# EAGLE schematic KELU1-0232 (EAGLE 9.0.0)

## Sheet 1 of 7: IGBT Bridge
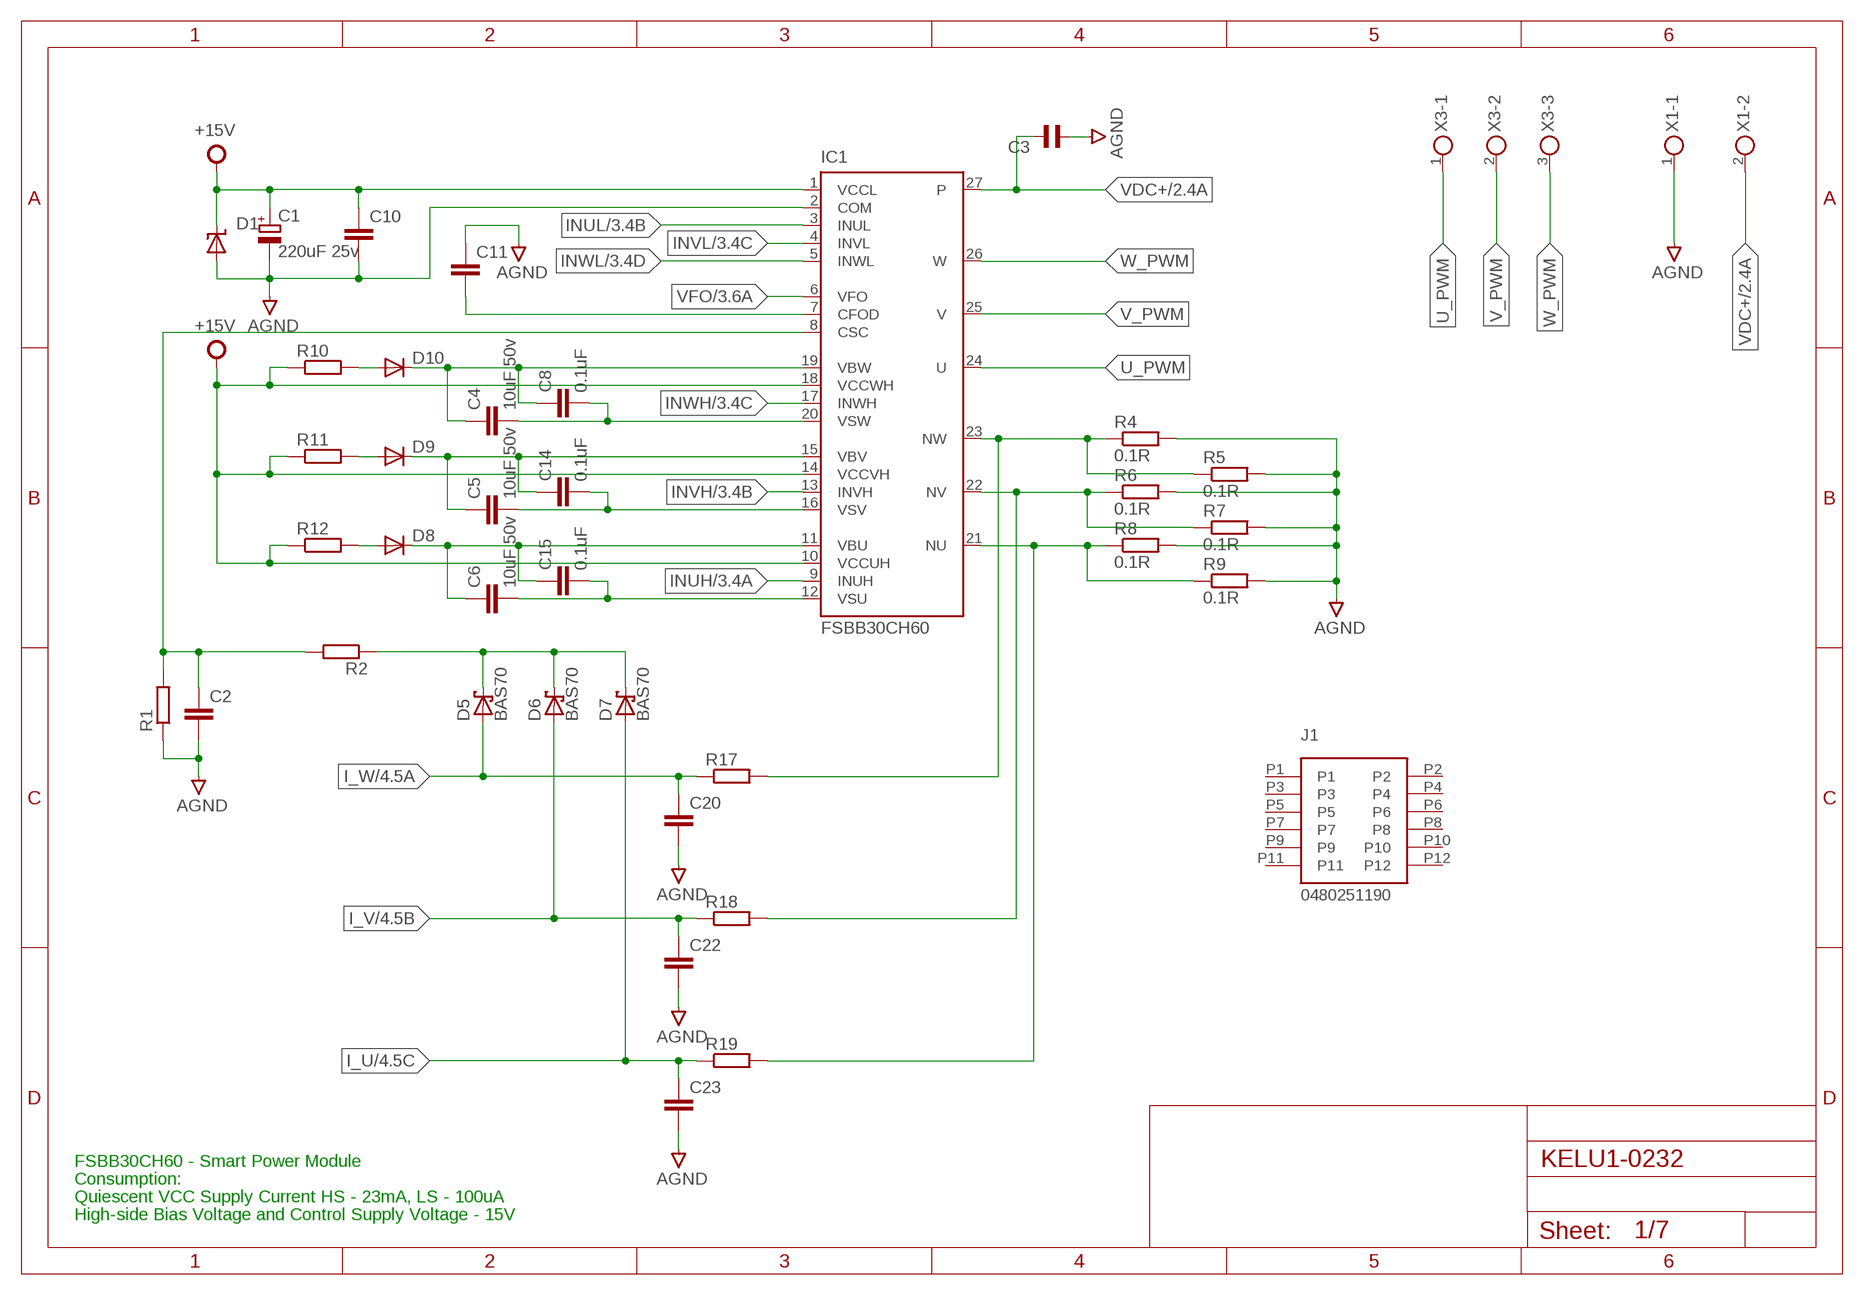
[diagram p0: schematic, sheet 1]

### Parts
C1  220uF 25v  CPOL-EU140CLH-1010  [140CLH-1010]
C2  C-EUC0603  [C0603]
C3  C-EU150-091X182  [C150-091X182]
C4  10uF 50v  C-EUC1210K  [C1210K]
C5  10uF 50v  C-EUC1210K  [C1210K]
C6  10uF 50v  C-EUC1210K  [C1210K]
C8  0.1uF  C-EUC0805  [C0805]
C10  C-EUC0603  [C0603]
C11  C-EUC0603  [C0603]
C14  0.1uF  C-EUC0805  [C0805]
C15  0.1uF  C-EUC0805  [C0805]
C20  C-EUC0603  [C0603]
C22  C-EUC0603  [C0603]
C23  C-EUC0603  [C0603]
D1  SUPPRESSOR-SMBJ  [SMBJ]
D5  BAS70  [SOT23]
D6  BAS70  [SOT23]
D7  BAS70  [SOT23]
D8  DIODE-MELF-MLL41  [MELF-MLL41]
D9  DIODE-MELF-MLL41  [MELF-MLL41]
D10  DIODE-MELF-MLL41  [MELF-MLL41]
IC1  FSBB30CH60  [FSBB30CH60]
J1  0480251190  [JACK]
R1  R-EU_R0603  [R0603]
R2  R-EU_R0603  [R0603]
R4  0.1R  R-EU_R2512  [R2512]
R5  0.1R  R-EU_R2512  [R2512]
R6  0.1R  R-EU_R2512  [R2512]
R7  0.1R  R-EU_R2512  [R2512]
R8  0.1R  R-EU_R2512  [R2512]
R9  0.1R  R-EU_R2512  [R2512]
R10  R-EU_R1206  [R1206]
R11  R-EU_R1206  [R1206]
R12  R-EU_R1206  [R1206]
R17  R-EU_R0603  [R0603]
R18  R-EU_R0603  [R0603]
R19  R-EU_R0603  [R0603]
X1  DG129-7.5-02P  [DG129-7.5-02P-14-00A]
X3  DG129-7.5-03P  [DG129-7.5-03P-14-00A]

### Nets
+15V: C1.+ C10.1 D1.C IC1.1(VCCL) IC1.10(VCCUH) IC1.14(VCCVH) IC1.18(VCCWH) R10.1 R11.1 R12.1 ; also sheet 2,7
AGND: C1.- C2.2 C3.2 C10.2 C11.1 C20.2 C22.2 C23.2 D1.A IC1.2(COM) R1.1 R4.2 R5.2 R6.2 R7.2 R8.2 R9.2 X1.1 ; also sheet 2,3,4,5,7
I_U: C23.1 D7.1(A) R19.1 ; also sheet 4
I_V: C22.1 D6.1(A) R18.1 ; also sheet 4
I_W: C20.1 D5.1(A) R17.1 ; also sheet 4
INUH: IC1.9(INUH) ; also sheet 3
INUL: IC1.3(INUL) ; also sheet 3
INVH: IC1.13(INVH) ; also sheet 3
INVL: IC1.4(INVL) ; also sheet 3
INWH: IC1.17(INWH) ; also sheet 3
INWL: IC1.5(INWL) ; also sheet 3
N$1: D8.A R12.2
N$2: D9.A R11.2
N$3: C11.2 IC1.7(CFOD)
N$4: D10.A R10.2
N$5: C4.1 C8.1 D10.C IC1.19(VBW)
N$6: C5.1 C14.1 D9.C IC1.15(VBV)
N$7: C6.1 C15.1 D8.C IC1.11(VBU)
N$8: C5.2 C14.2 IC1.16(VSV)
N$9: C6.2 C15.2 IC1.12(VSU)
N$10: C4.2 C8.2 IC1.20(VSW)
N$11: IC1.23(NW) R4.1 R5.1 R17.2
N$12: IC1.22(NV) R6.1 R7.1 R18.2
N$13: IC1.21(NU) R8.1 R9.1 R19.2
N$14: C2.1 IC1.8(CSC) R1.2 R2.2
N$15: D5.3(C) D6.3(C) D7.3(C) R2.1
U_PWM: IC1.24(U) X3.1
V_PWM: IC1.25(V) X3.2
VDC+: C3.1 IC1.27(P) X1.2 ; also sheet 2,5
VFO: IC1.6(VFO) ; also sheet 3
W_PWM: IC1.26(W) X3.3
Unconnected: J1.P1 J1.P2 J1.P3 J1.P4 J1.P5 J1.P6 J1.P7 J1.P8 J1.P9 J1.P10 J1.P11 J1.P12

### Notes on the sheet
- FSBB30CH60 - Smart Power Module
- Consumption:
- Quiescent VCC Supply Current HS - 23mA, LS - 100uA
- High-side Bias Voltage and Control Supply Voltage - 15V

## Sheet 2 of 7: Brake and Soft
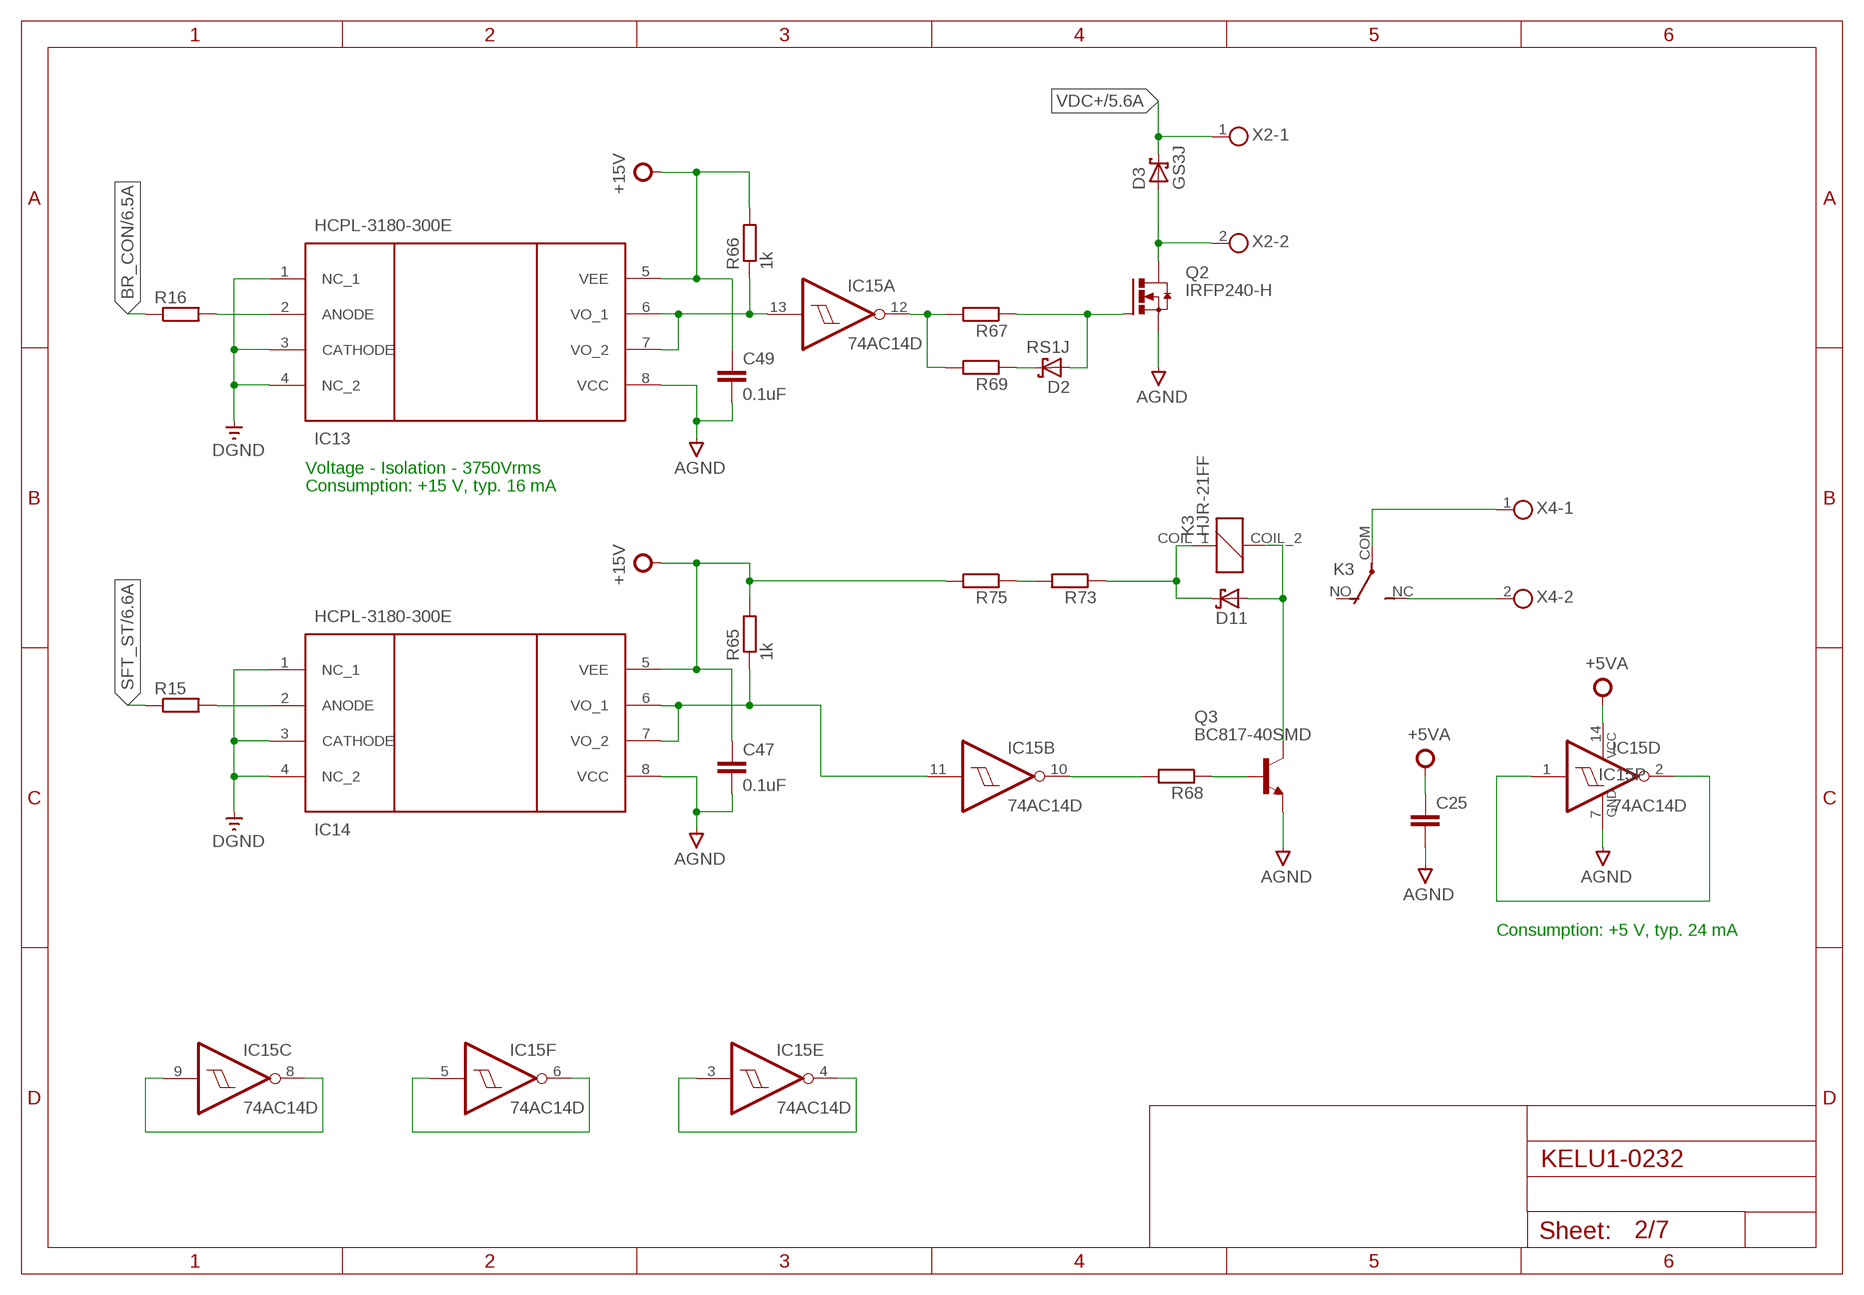
[diagram p1: schematic, sheet 2]

### Parts
C25  C-EUC0603  [C0603]
C47  0.1uF  C-EUC1206  [C1206]
C49  0.1uF  C-EUC1206  [C1206]
D2  RS1J  SCHOTTKY_SMA  [DIOM5326X292N]
D3  GS3J  SCHOTTKY_SMC  [DIOM7959X265N]
D11  SCHOTTKY_SMA  [DIOM5326X292N]
IC13  HCPL-3180-300E  [HCPL-3180]
IC14  HCPL-3180-300E  [HCPL-3180]
IC15  74AC14D  [SO14]
K3  HJR-21FF  [HJR21FF]
Q2  IRFP240-H  [TO247BH]
Q3  BC817-40SMD  [SOT23-BEC]
R15  R-EU_R0603  [R0603]
R16  R-EU_R0603  [R0603]
R65  1k  R-EU_M0805  [M0805]
R66  1k  R-EU_M0805  [M0805]
R67  R-EU_M0805  [M0805]
R68  R-EU_M0805  [M0805]
R69  R-EU_M0805  [M0805]
R73  R-EU_M0805  [M0805]
R75  R-EU_M0805  [M0805]
X2  DG129-7.5-02P  [DG129-7.5-02P-14-00A]
X4  DG129-7.5-02P  [DG129-7.5-02P-14-00A]

### Nets
+5VA: C25.1 IC15.14(P:VCC) ; also sheet 3,4,5,7
+15V: C47.1 C49.1 IC13.5(VEE) IC14.5(VEE) R65.2 R66.2 R75.2 ; also sheet 1,7
AGND: C25.2 C47.2 C49.2 IC13.8(VCC) IC14.8(VCC) IC15.7(P:GND) Q2.S Q3.E ; also sheet 1,3,4,5,7
BR_CON: R16.1 ; also sheet 6
DGND: IC13.1(NC_1) IC13.3(CATHODE) IC13.4(NC_2) IC14.1(NC_1) IC14.3(CATHODE) IC14.4(NC_2) ; also sheet 3,4,5,6,7
N$36: IC13.2(ANODE) R16.2
N$47: IC14.2(ANODE) R15.2
N$48: Q3.B R68.1
N$53: IC13.6(VO_1) IC13.7(VO_2) IC15.13(A:I) R66.1
N$56: IC15.12(A:O) R67.2 R69.2
N$60: IC14.6(VO_1) IC14.7(VO_2) IC15.11(B:I) R65.1
N$61: IC15.10(B:O) R68.2
N$65: D2.A Q2.G R67.1
N$67: D2.K R69.1
N$69: K3.COM X4.1
N$72: K3.NC X4.2
N$74: D3.A Q2.D X2.2
N$75: D11.K K3.COIL_1 R73.1
N$77: D11.A K3.COIL_2 Q3.C
N$79: R73.2 R75.1
N$81: IC15.1(D:I) IC15.2(D:O)
N$86: IC15.8(C:O) IC15.9(C:I)
N$89: IC15.5(F:I) IC15.6(F:O)
N$91: IC15.3(E:I) IC15.4(E:O)
SFT_ST: R15.1 ; also sheet 6
VDC+: D3.K X2.1 ; also sheet 1,5
Unconnected: K3.NO

### Notes on the sheet
- Voltage - Isolation - 3750Vrms
- Consumption: +15 V, typ. 16 mA
- Consumption: +5 V, typ. 24 mA

## Sheet 3 of 7: Opto Driver
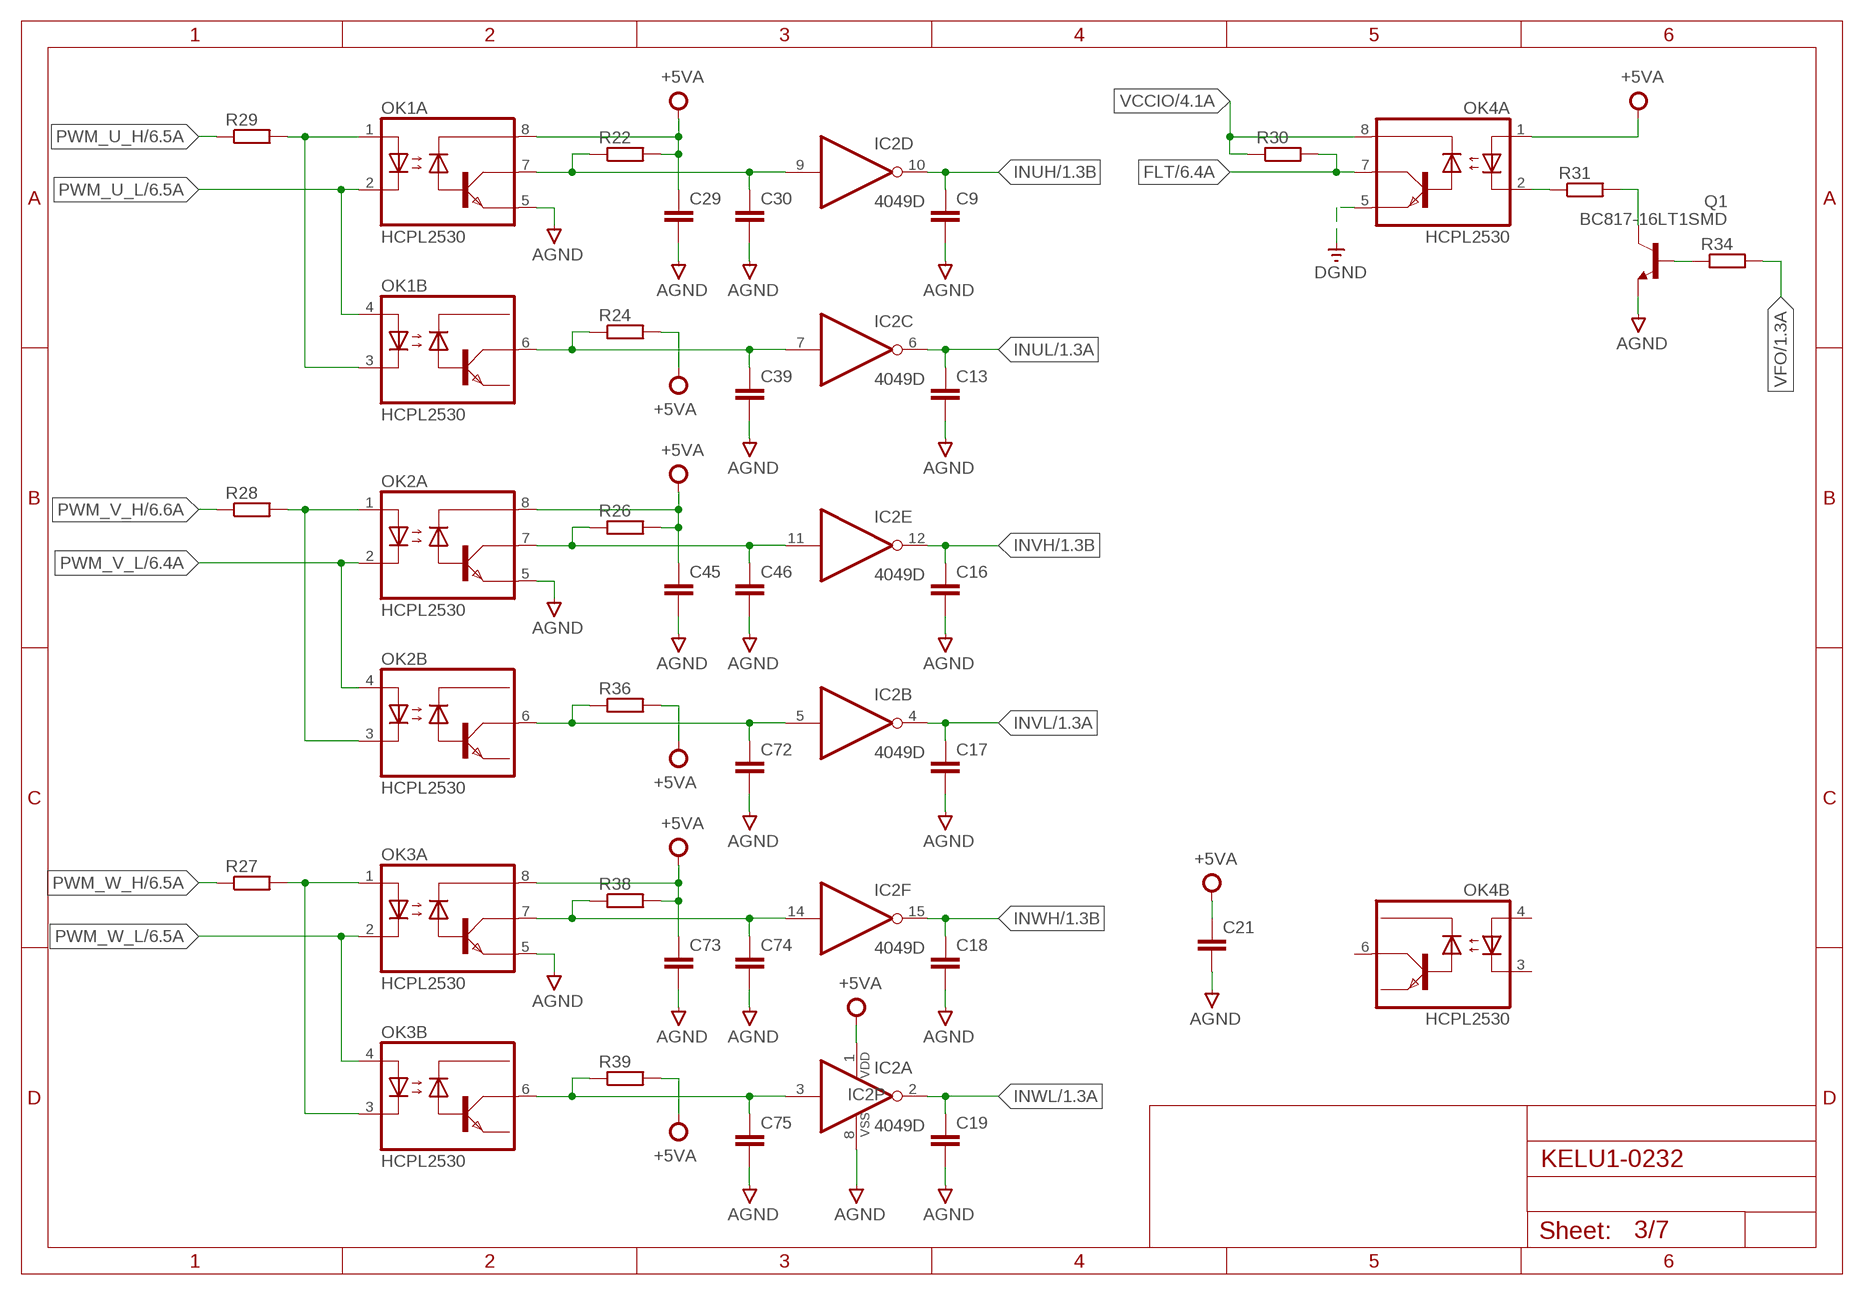
[diagram p2: schematic, sheet 3]

### Parts
C9  C-EUC0603  [C0603]
C13  C-EUC0603  [C0603]
C16  C-EUC0603  [C0603]
C17  C-EUC0603  [C0603]
C18  C-EUC0603  [C0603]
C19  C-EUC0603  [C0603]
C21  C-EUC0603  [C0603]
C29  C-EUC0603  [C0603]
C30  C-EUC0603  [C0603]
C39  C-EUC0603  [C0603]
C45  C-EUC0603  [C0603]
C46  C-EUC0603  [C0603]
C72  C-EUC0603  [C0603]
C73  C-EUC0603  [C0603]
C74  C-EUC0603  [C0603]
C75  C-EUC0603  [C0603]
IC2  4049D  [SO16]
OK1  HCPL2530  [DIL08]
OK2  HCPL2530  [DIL08]
OK3  HCPL2530  [DIL08]
OK4  HCPL2530  [DIL08]
Q1  BC817-16LT1SMD  [SOT23-BEC]
R22  R-EU_R0603  [R0603]
R24  R-EU_R0603  [R0603]
R26  R-EU_R0603  [R0603]
R27  R-EU_R0603  [R0603]
R28  R-EU_R0603  [R0603]
R29  R-EU_R0603  [R0603]
R30  R-EU_R0603  [R0603]
R31  R-EU_R0603  [R0603]
R34  R-EU_R0603  [R0603]
R36  R-EU_R0603  [R0603]
R38  R-EU_R0603  [R0603]
R39  R-EU_R0603  [R0603]

### Nets
+5VA: C21.1 C29.1 C45.1 C73.1 IC2.1(P:VDD) OK1.8(A:VCC) OK2.8(A:VCC) OK3.8(A:VCC) OK4.1(A:A1) R22.2 R24.2 R26.2 R36.2 R38.2 R39.2 ; also sheet 2,4,5,7
AGND: C9.2 C13.2 C16.2 C17.2 C18.2 C19.2 C21.2 C29.2 C30.2 C39.2 C45.2 C46.2 C72.2 C73.2 C74.2 C75.2 IC2.8(P:VSS) OK1.5(A:GND) OK2.5(A:GND) OK3.5(A:GND) Q1.E ; also sheet 1,2,4,5,7
DGND: OK4.5(A:GND) ; also sheet 2,4,5,6,7
FLT: OK4.7(A:VO1) R30.2 ; also sheet 6
INUH: C9.1 IC2.10(D:O) ; also sheet 1
INUL: C13.1 IC2.6(C:O) ; also sheet 1
INVH: C16.1 IC2.12(E:O) ; also sheet 1
INVL: C17.1 IC2.4(B:O) ; also sheet 1
INWH: C18.1 IC2.15(F:O) ; also sheet 1
INWL: C19.1 IC2.2(A:O) ; also sheet 1
N$18: C30.1 IC2.9(D:I) OK1.7(A:VO1) R22.1
N$19: C39.1 IC2.7(C:I) OK1.6(B:VO2) R24.1
N$23: OK1.1(A:A1) OK1.3(B:C2) R29.2
N$25: C46.1 IC2.11(E:I) OK2.7(A:VO1) R26.1
N$26: C72.1 IC2.5(B:I) OK2.6(B:VO2) R36.1
N$29: OK2.1(A:A1) OK2.3(B:C2) R28.2
N$31: C74.1 IC2.14(F:I) OK3.7(A:VO1) R38.1
N$34: OK4.2(A:C1) R31.1
N$35: C75.1 IC2.3(A:I) OK3.6(B:VO2) R39.1
N$37: OK3.1(A:A1) OK3.3(B:C2) R27.2
N$38: Q1.C R31.2
N$39: Q1.B R34.1
PWM_U_H: R29.1 ; also sheet 6
PWM_U_L: OK1.2(A:C1) OK1.4(B:A2) ; also sheet 6
PWM_V_H: R28.1 ; also sheet 6
PWM_V_L: OK2.2(A:C1) OK2.4(B:A2) ; also sheet 6
PWM_W_H: R27.1 ; also sheet 6
PWM_W_L: OK3.2(A:C1) OK3.4(B:A2) ; also sheet 6
VCCIO: OK4.8(A:VCC) R30.1 ; also sheet 4,5,6,7
VFO: R34.2 ; also sheet 1
Unconnected: OK4.3(B:C2) OK4.4(B:A2) OK4.6(B:VO2)

## Sheet 4 of 7: Current Sense
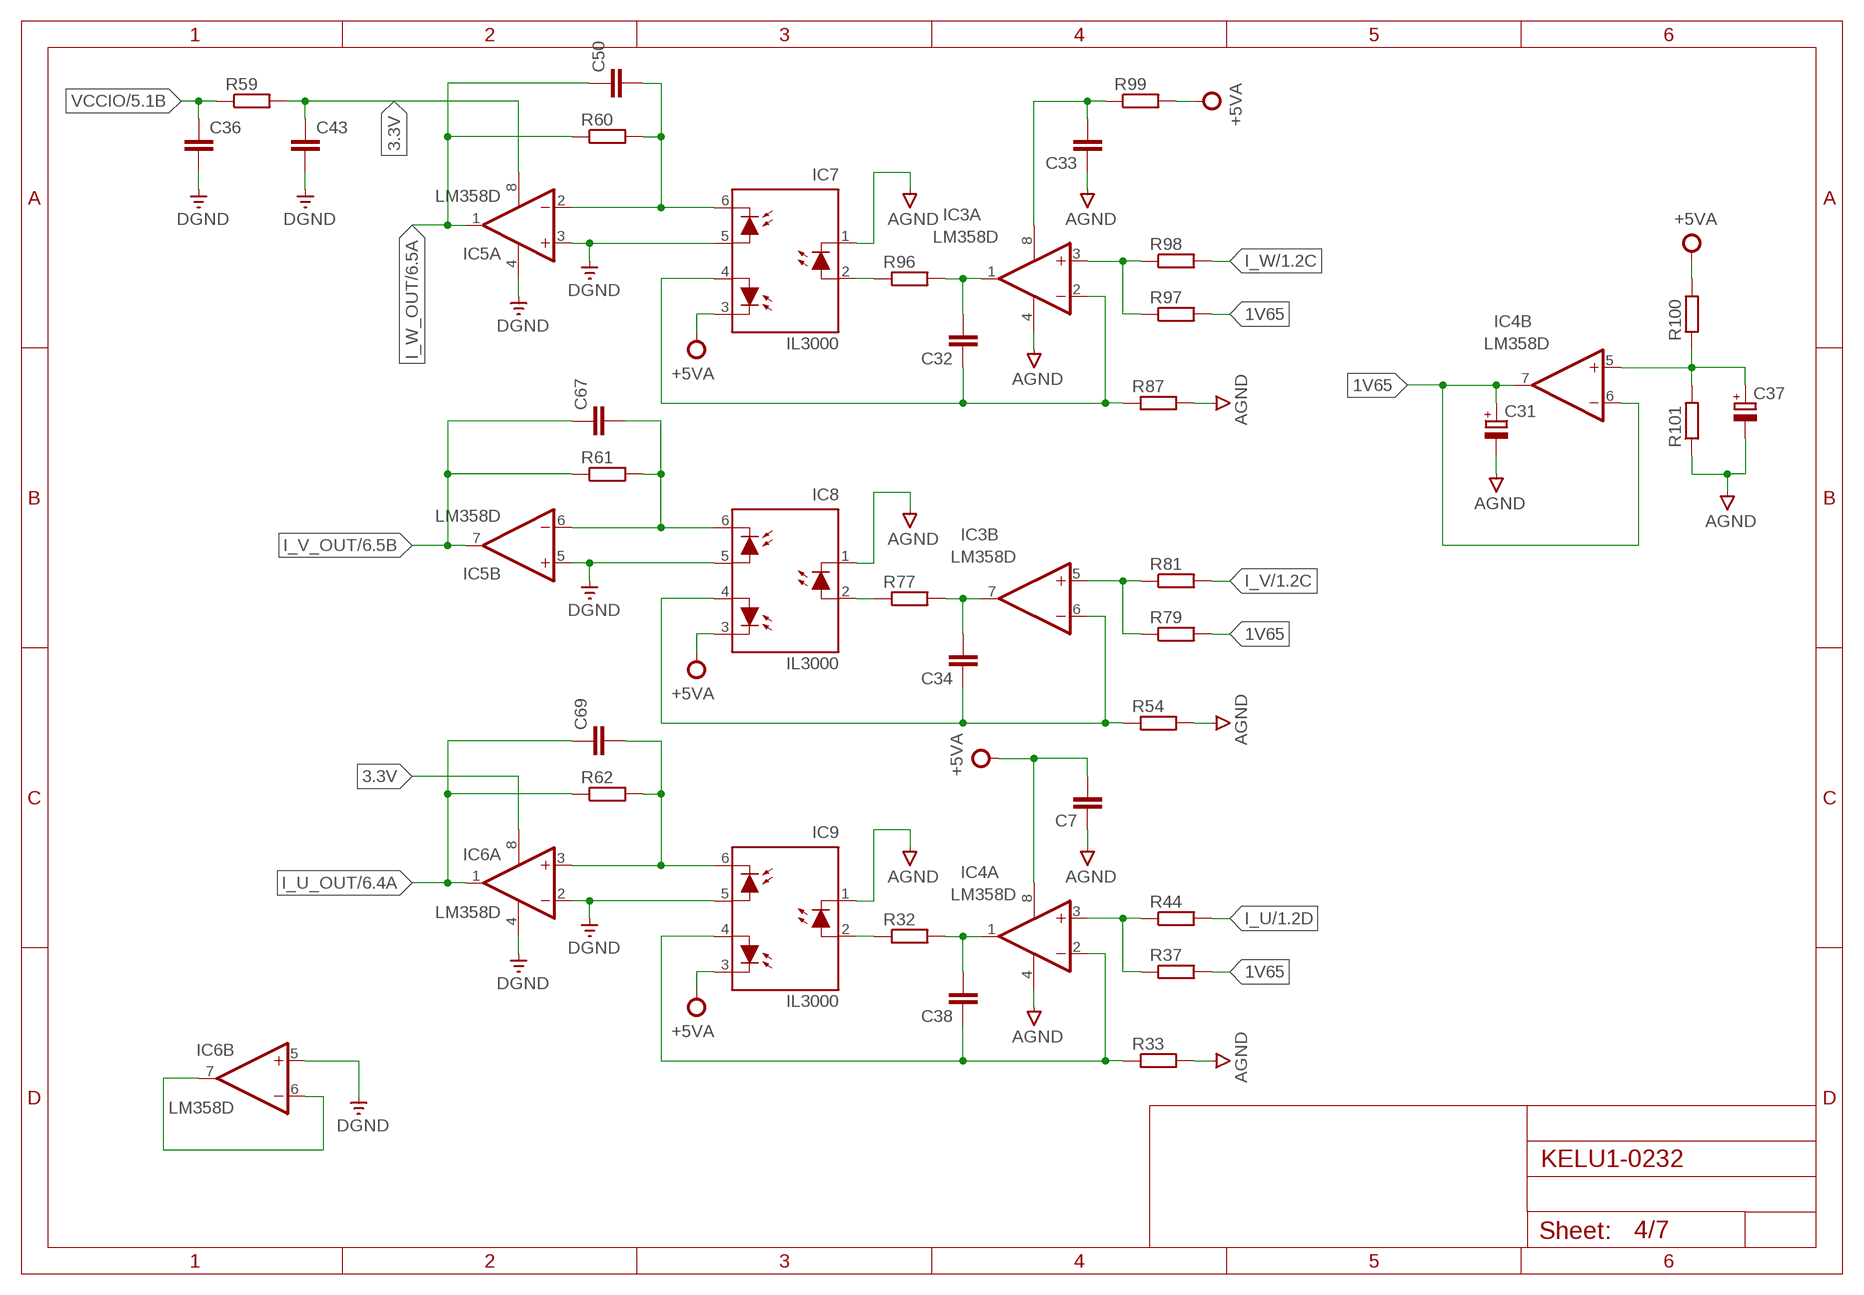
[diagram p3: schematic, sheet 4]

### Parts
C7  C-EUC0603  [C0603]
C31  CPOL-EUSMCB  [SMC_B]
C32  C-EUC0603  [C0603]
C33  C-EUC0603  [C0603]
C34  C-EUC0603  [C0603]
C36  C-EUC0603  [C0603]
C37  CPOL-EUSMCB  [SMC_B]
C38  C-EUC0603  [C0603]
C43  C-EUC0603  [C0603]
C50  C-EUC0603  [C0603]
C67  C-EUC0603  [C0603]
C69  C-EUC0603  [C0603]
IC3  LM358D  [SO08]
IC4  LM358D  [SO08]
IC5  LM358D  [SO08]
IC6  LM358D  [SO08]
IC7  IL3000  [DIL08-400]
IC8  IL3000  [DIL08-400]
IC9  IL3000  [DIL08-400]
R32  R-EU_R0603  [R0603]
R33  R-EU_R0603  [R0603]
R37  R-EU_R0603  [R0603]
R44  R-EU_R0603  [R0603]
R54  R-EU_R0603  [R0603]
R59  R-EU_R0603  [R0603]
R60  R-EU_R0603  [R0603]
R61  R-EU_R0603  [R0603]
R62  R-EU_R0603  [R0603]
R77  R-EU_R0603  [R0603]
R79  R-EU_R0603  [R0603]
R81  R-EU_R0603  [R0603]
R87  R-EU_R0603  [R0603]
R96  R-EU_R0603  [R0603]
R97  R-EU_R0603  [R0603]
R98  R-EU_R0603  [R0603]
R99  R-EU_R0603  [R0603]
R100  R-EU_R0603  [R0603]
R101  R-EU_R0603  [R0603]

### Nets
1V65: C31.+ IC4.6(B:-IN) IC4.7(B:OUT) R37.2 R79.2 R97.2
3.3V: C43.1 IC5.8(P:V+) IC6.8(P:V+) R59.2
5VA: C33.2 IC3.8(P:V+) R99.1
+5VA: C7.2 IC4.8(P:V+) IC7.3(C3) IC8.3(C3) IC9.3(C3) R99.2 R100.2 ; also sheet 2,3,5,7
AGND: C7.1 C31.- C33.1 C37.- IC3.4(P:V-) IC4.4(P:V-) IC7.1(C1) IC8.1(C1) IC9.1(C1) R33.2 R54.2 R87.2 R101.1 ; also sheet 1,2,3,5,7
DGND: C36.2 C43.2 IC5.3(A:+IN) IC5.4(P:V-) IC5.5(B:+IN) IC6.2(A:-IN) IC6.4(P:V-) IC6.5(B:+IN) IC7.5(A5) IC8.5(A5) IC9.5(A5) ; also sheet 2,3,5,6,7
I_U: R44.2 ; also sheet 1
I_U_OUT: C69.1 IC6.1(A:OUT) R62.1 ; also sheet 6
I_V: R81.2 ; also sheet 1
I_V_OUT: C67.1 IC5.7(B:OUT) R61.1 ; also sheet 6
I_W: R98.2 ; also sheet 1
I_W_OUT: C50.1 IC5.1(A:OUT) R60.1 ; also sheet 6
N$28: C32.2 IC3.1(A:OUT) R96.2
N$40: IC7.2(A2) R96.1
N$41: IC3.3(A:+IN) R97.1 R98.1
N$42: C37.+ IC4.5(B:+IN) R100.1 R101.2
N$44: C50.2 IC5.2(A:-IN) IC7.6(C6) R60.2
N$50: C32.1 IC3.2(A:-IN) IC7.4(A4) R87.1
N$54: IC8.2(A2) R77.1
N$55: C34.2 IC3.7(B:OUT) R77.2
N$57: C34.1 IC3.6(B:-IN) IC8.4(A4) R54.1
N$58: C67.2 IC5.6(B:-IN) IC8.6(C6) R61.2
N$59: C69.2 IC6.3(A:+IN) IC9.6(C6) R62.2
N$62: IC9.2(A2) R32.1
N$63: IC3.5(B:+IN) R79.1 R81.1
N$64: C38.2 IC4.1(A:OUT) R32.2
N$66: IC6.6(B:-IN) IC6.7(B:OUT)
N$68: C38.1 IC4.2(A:-IN) IC9.4(A4) R33.1
N$70: IC4.3(A:+IN) R37.1 R44.1
VCCIO: C36.1 R59.1 ; also sheet 3,5,6,7

## Sheet 5 of 7: Voltage Sense
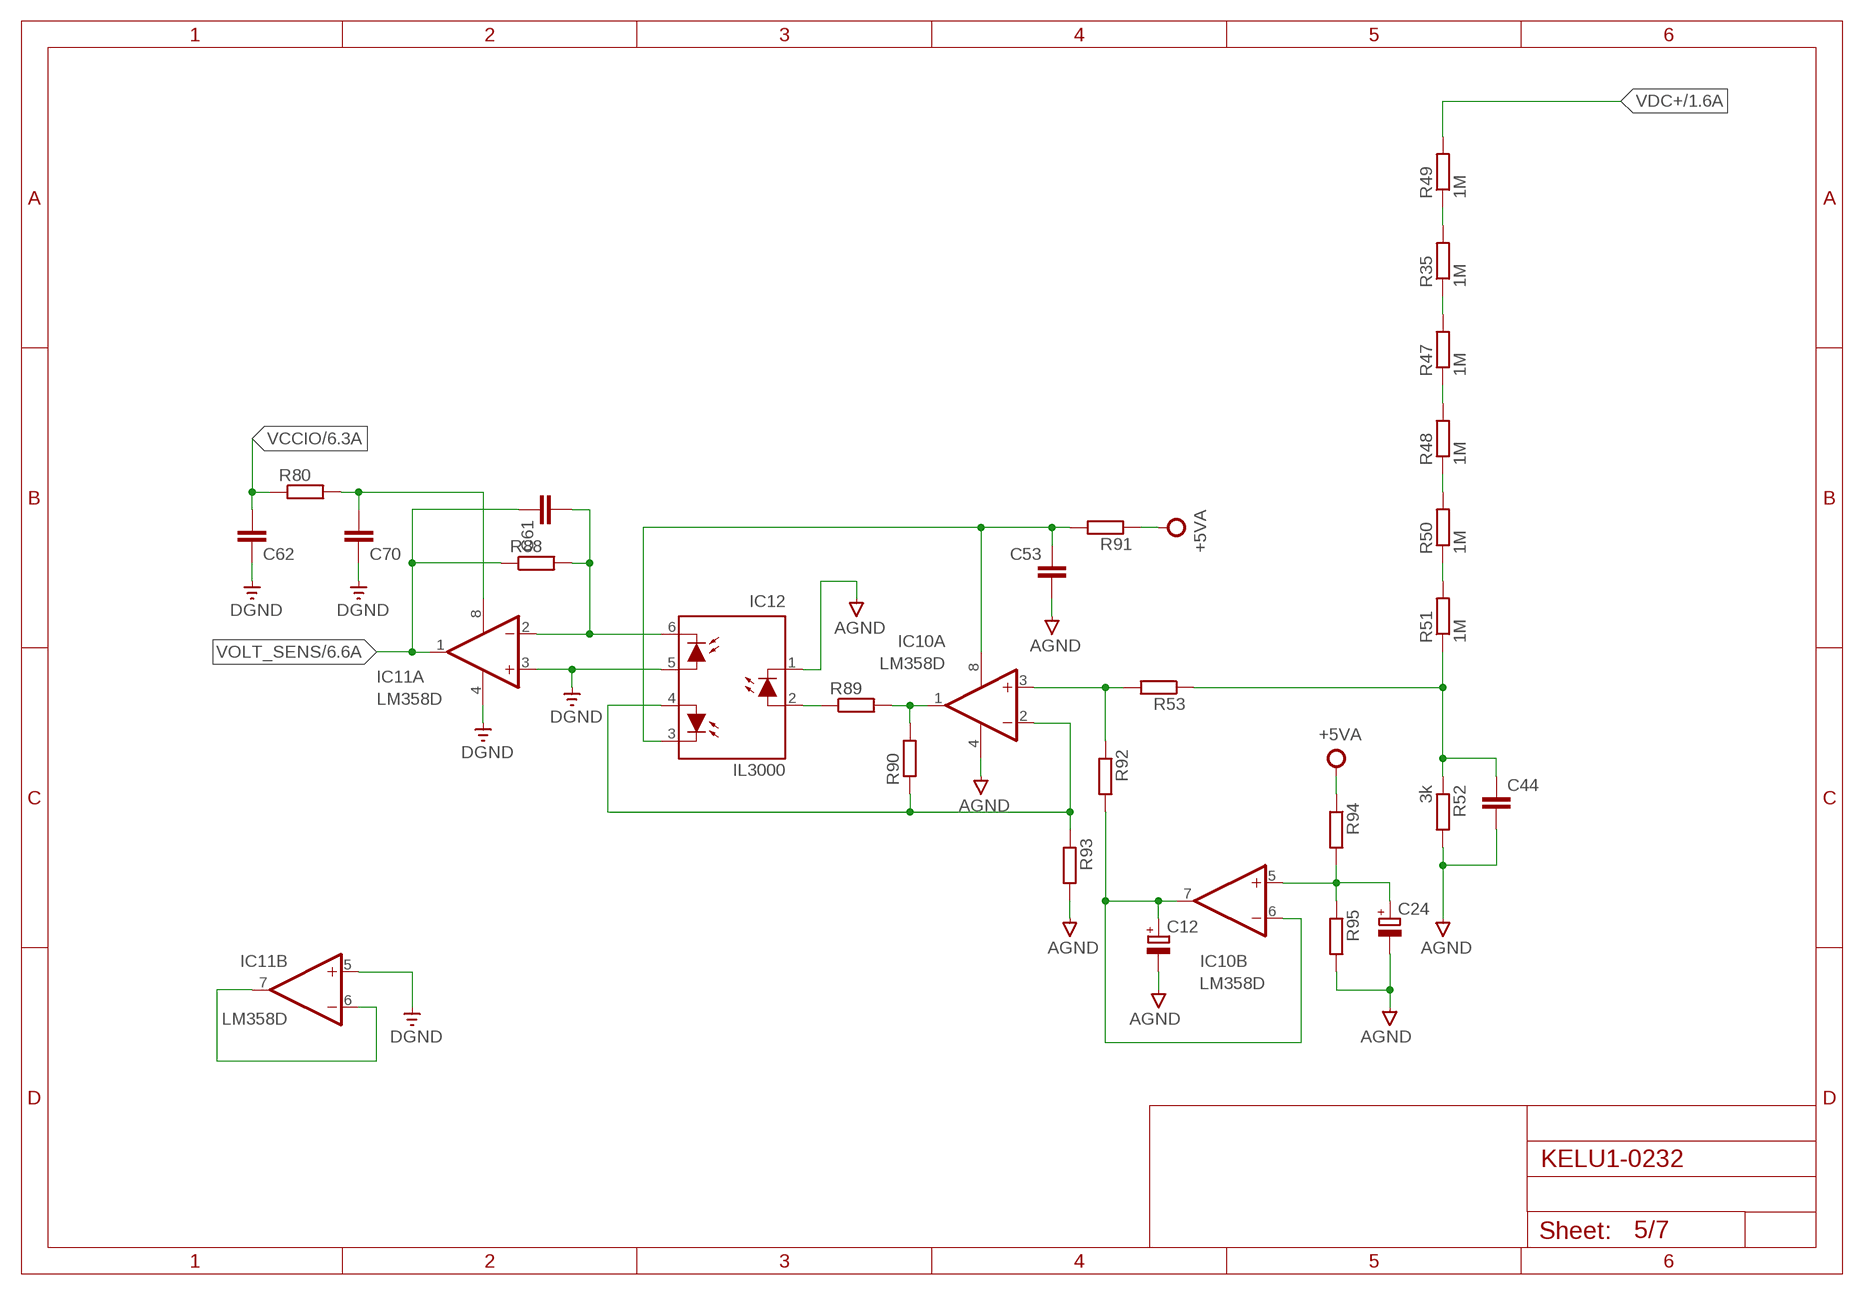
[diagram p4: schematic, sheet 5]

### Parts
C12  CPOL-EUSMCB  [SMC_B]
C24  CPOL-EUSMCB  [SMC_B]
C44  C-EUC1206  [C1206]
C53  C-EUC0603  [C0603]
C61  C-EUC0603  [C0603]
C62  C-EUC0603  [C0603]
C70  C-EUC0603  [C0603]
IC10  LM358D  [SO08]
IC11  LM358D  [SO08]
IC12  IL3000  [DIL08-400]
R35  1M  R-EU_M1206  [M1206]
R47  1M  R-EU_M1206  [M1206]
R48  1M  R-EU_M1206  [M1206]
R49  1M  R-EU_M1206  [M1206]
R50  1M  R-EU_M1206  [M1206]
R51  1M  R-EU_M1206  [M1206]
R52  3k  R-EU_M1206  [M1206]
R53  R-EU_R0603  [R0603]
R80  R-EU_R0603  [R0603]
R88  R-EU_R0603  [R0603]
R89  R-EU_R0603  [R0603]
R90  R-EU_R0603  [R0603]
R91  R-EU_R0603  [R0603]
R92  R-EU_R0603  [R0603]
R93  R-EU_R0603  [R0603]
R94  R-EU_R0603  [R0603]
R95  R-EU_R0603  [R0603]

### Nets
+5VA: R91.1 R94.1 ; also sheet 2,3,4,7
AGND: C12.- C24.- C44.2 C53.2 IC10.4(P:V-) IC12.1(C1) R52.2 R93.2 R95.2 ; also sheet 1,2,3,4,7
DGND: C62.1 C70.1 IC11.3(A:+IN) IC11.4(P:V-) IC11.5(B:+IN) IC12.5(A5) ; also sheet 2,3,4,6,7
N$16: R50.1 R51.2
N$17: R48.1 R50.2
N$20: R47.1 R48.2
N$21: R35.1 R47.2
N$22: R35.2 R49.1
N$24: IC10.3(A:+IN) R53.2 R92.1
N$27: C44.1 R51.1 R52.1 R53.1
N$30: IC12.2(A2) R89.1
N$32: IC10.1(A:OUT) R89.2 R90.2
N$33: IC10.2(A:-IN) IC12.4(A4) R90.1 R93.1
N$43: C12.+ IC10.6(B:-IN) IC10.7(B:OUT) R92.2
N$45: C61.2 IC11.2(A:-IN) IC12.6(C6) R88.2
N$46: C53.1 IC10.8(P:V+) IC12.3(C3) R91.2
N$49: C70.2 IC11.8(P:V+) R80.2
N$52: C24.+ IC10.5(B:+IN) R94.2 R95.1
N$88: IC11.6(B:-IN) IC11.7(B:OUT)
VCCIO: C62.2 R80.1 ; also sheet 3,4,6,7
VDC+: R49.2 ; also sheet 1,2
VOLT_SENS: C61.1 IC11.1(A:OUT) R88.1 ; also sheet 6

## Sheet 6 of 7: NTC Sense
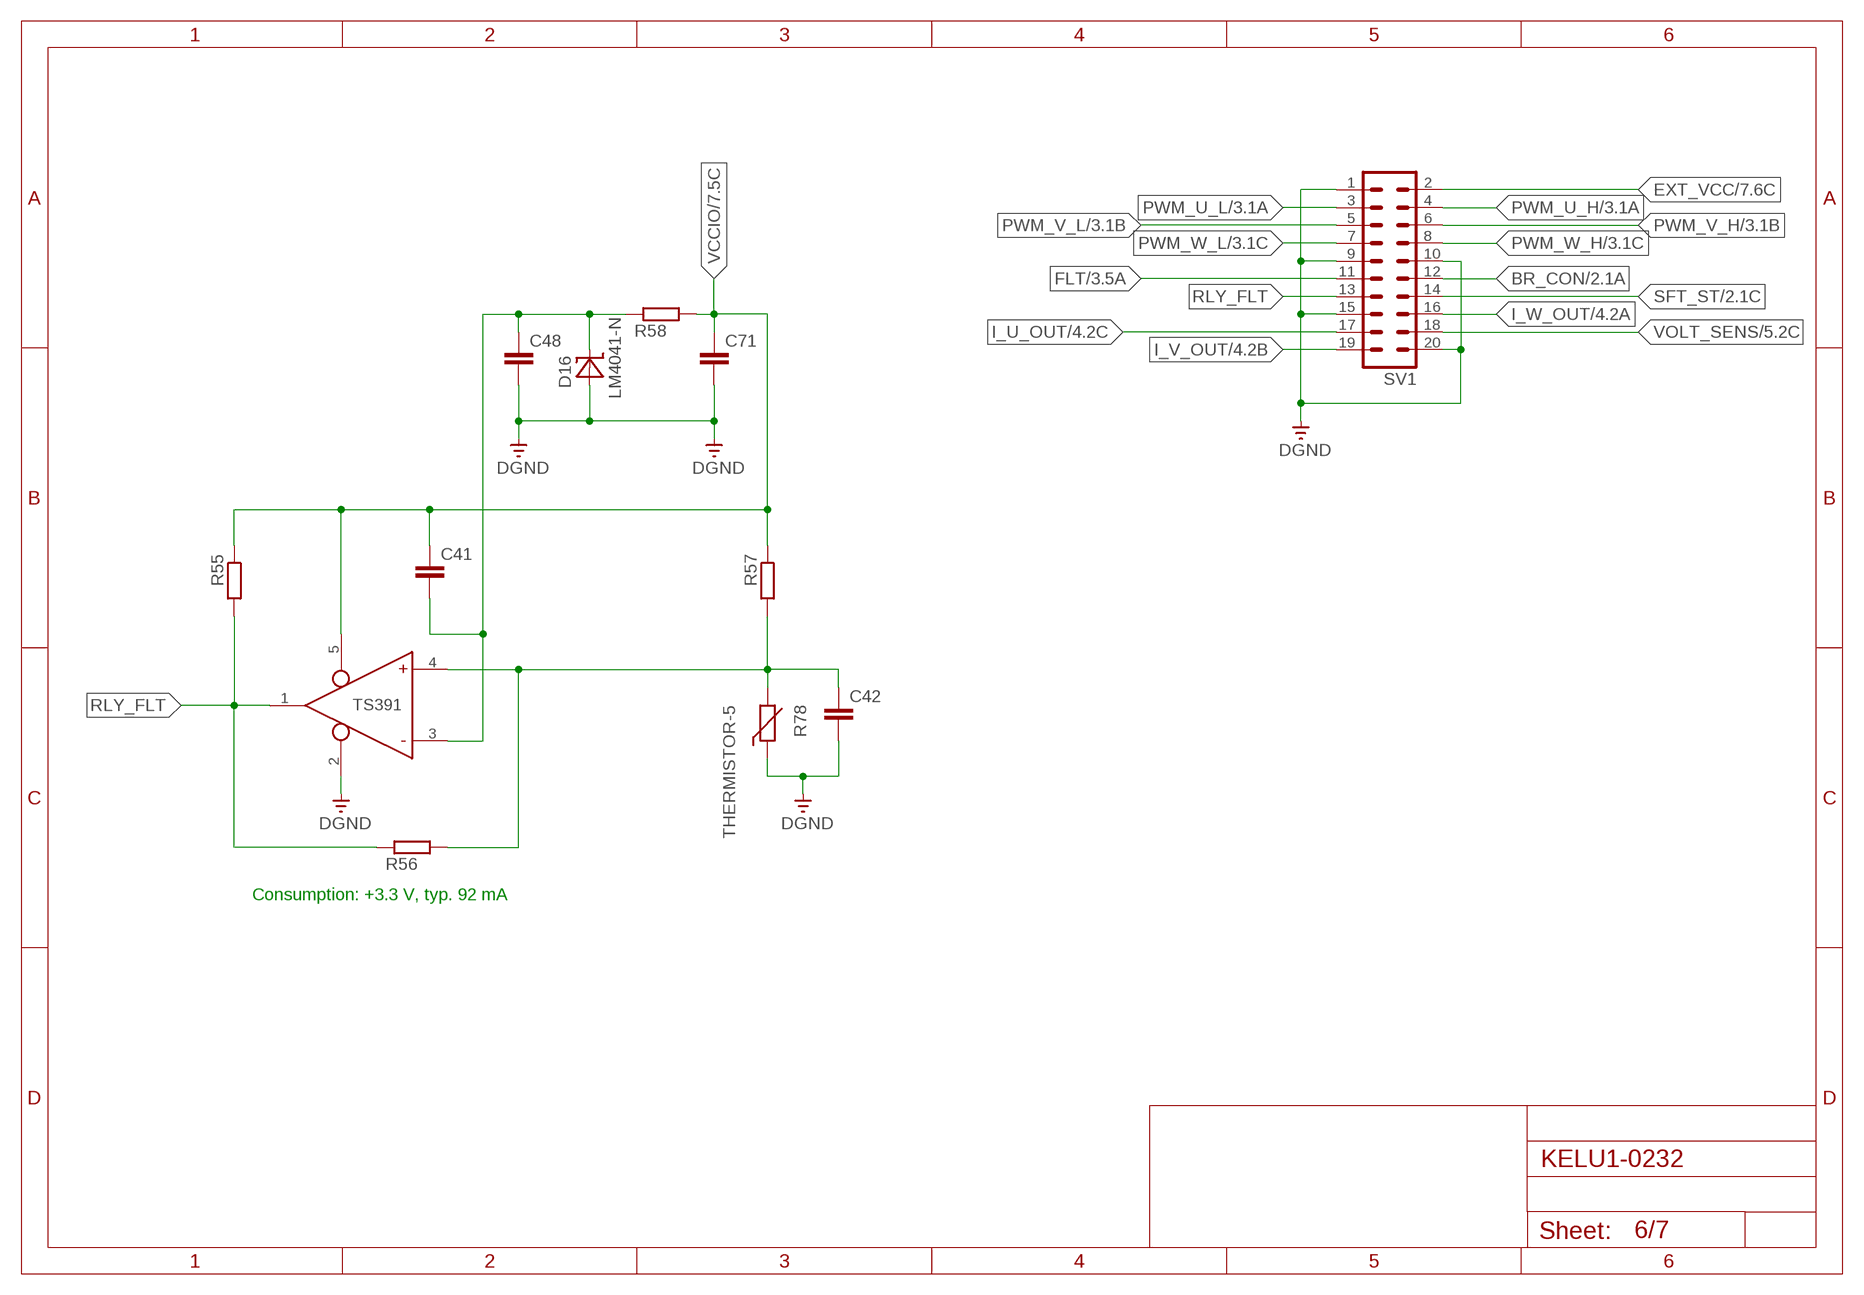
[diagram p5: schematic, sheet 6]

### Parts
C41  C-EUC0603  [C0603]
C42  C-EUC0603  [C0603]
C48  C-EUC0603  [C0603]
C71  C-EUC0603  [C0603]
D16  LM4041-N  [SOT23]
R55  R-EU_R0603  [R0603]
R56  R-EU_R0603  [R0603]
R57  R-EU_R0603  [R0603]
R58  R-EU_R0603  [R0603]
R78  THERMISTOR-5  [R-5]
SV1  ML20  [ML20]
U$2  TS391  [SOT23-5]

### Nets
BR_CON: SV1.12 ; also sheet 2
DGND: C42.2 C48.2 C71.2 D16.2(C) R78.1 SV1.1 SV1.9 SV1.10 SV1.15 SV1.20 U$2.2(GND) ; also sheet 2,3,4,5,7
EXT_VCC: SV1.2 ; also sheet 7
FLT: SV1.11 ; also sheet 3
I_U_OUT: SV1.17 ; also sheet 4
I_V_OUT: SV1.19 ; also sheet 4
I_W_OUT: SV1.16 ; also sheet 4
N$51: C42.1 R56.2 R57.2 R78.2 U$2.4(IN+)
N$71: C41.2 C48.1 D16.1(A) R58.1 U$2.3(IN-)
PWM_U_H: SV1.4 ; also sheet 3
PWM_U_L: SV1.3 ; also sheet 3
PWM_V_H: SV1.6 ; also sheet 3
PWM_V_L: SV1.5 ; also sheet 3
PWM_W_H: SV1.8 ; also sheet 3
PWM_W_L: SV1.7 ; also sheet 3
RLY_FLT: R55.2 R56.1 SV1.13 U$2.1(OUT)
SFT_ST: SV1.14 ; also sheet 2
VCCIO: C41.1 C71.1 R55.1 R57.1 R58.2 U$2.5(VCC) ; also sheet 3,4,5,7
VOLT_SENS: SV1.18 ; also sheet 5

### Notes on the sheet
- Consumption: +3.3 V, typ. 92 mA

## Sheet 7 of 7: Power Supply
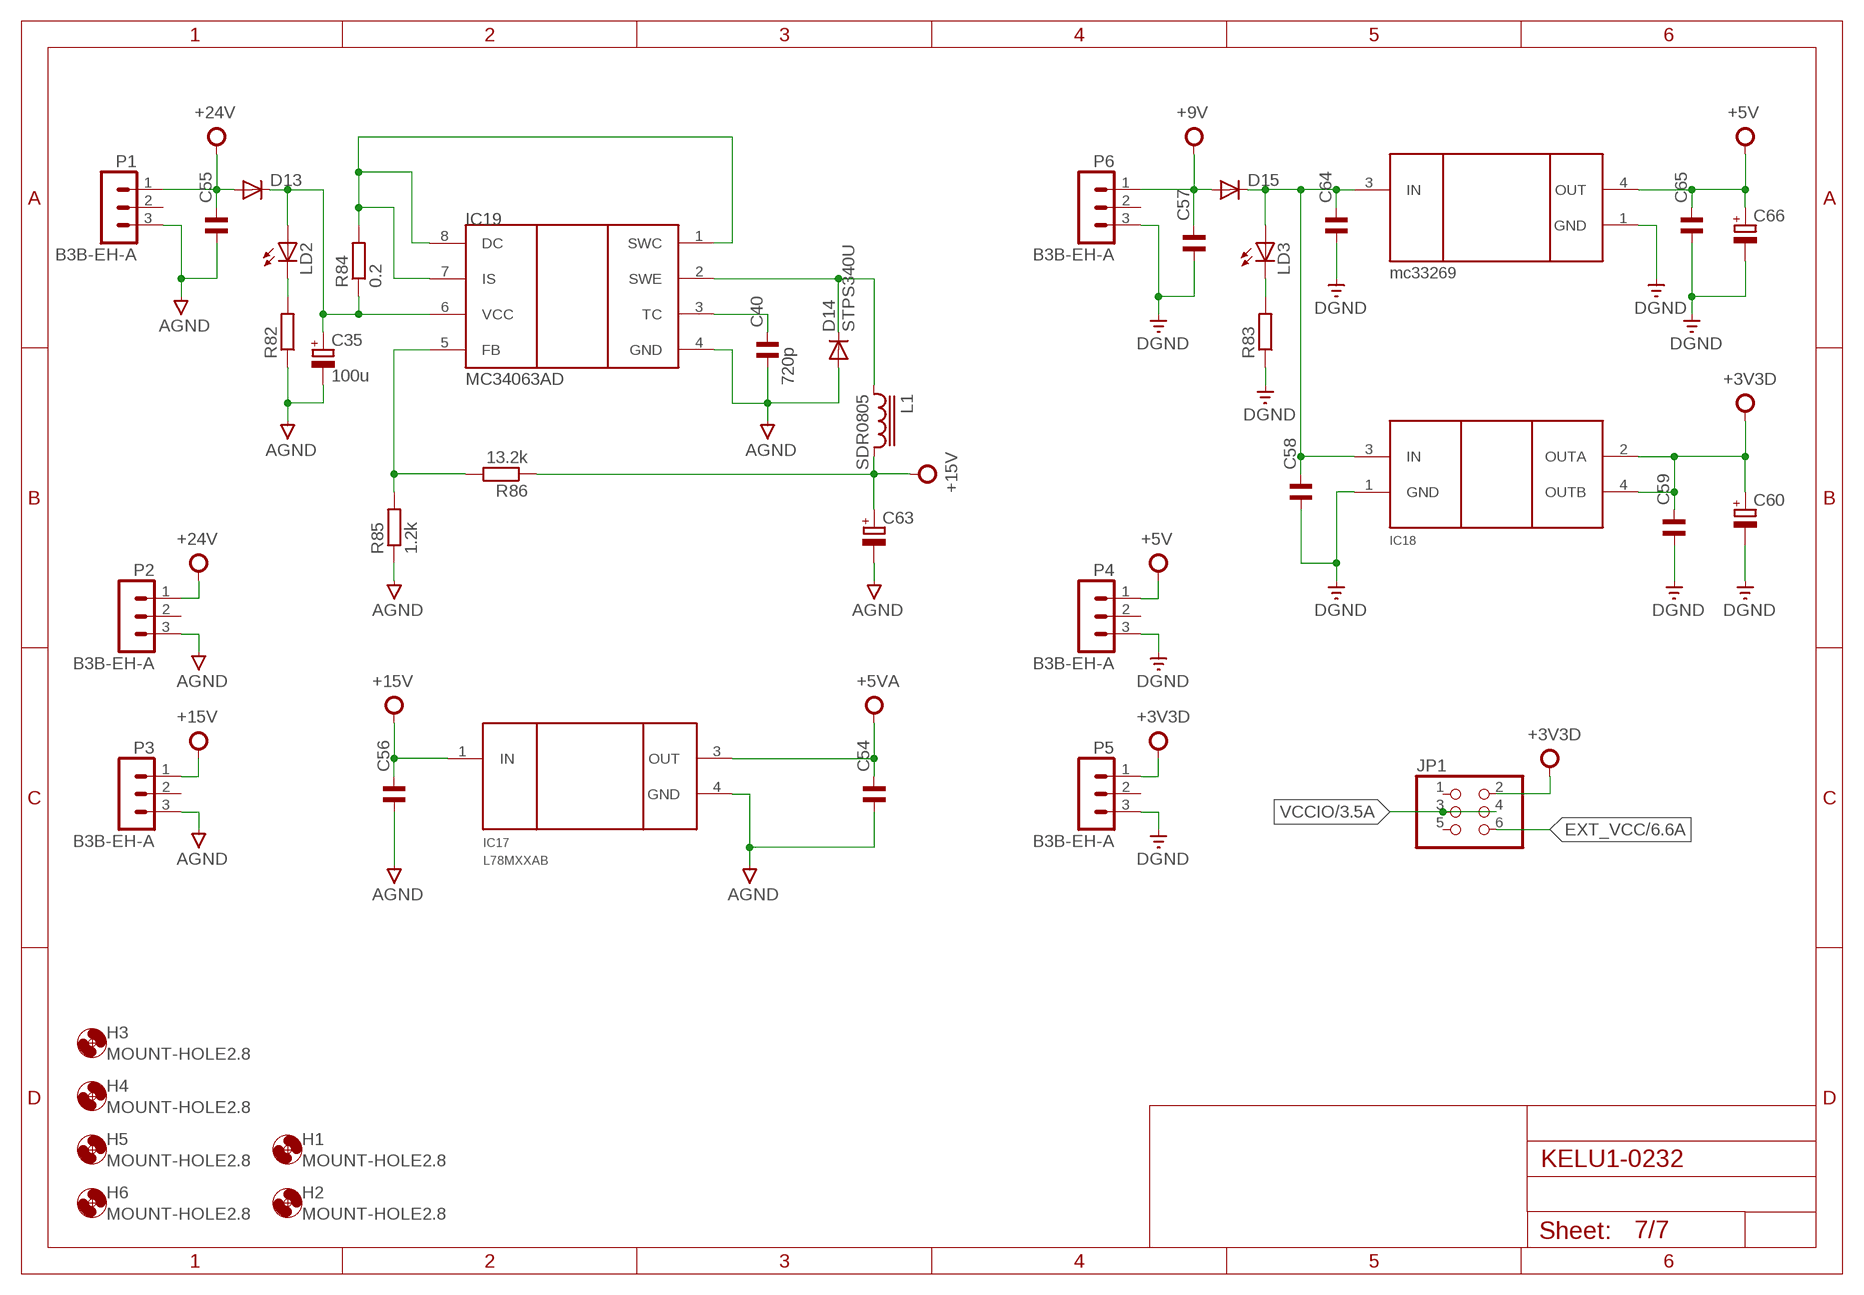
[diagram p6: schematic, sheet 7]

### Parts
C35  100u  CPOL-EU175TMP-0810  [175TMP-0810]
C40  720p  C-EUC0805  [C0805]
C54  C-EUC0805  [C0805]
C55  C-EUC0805  [C0805]
C56  C-EUC0805  [C0805]
C57  C-EUC0805  [C0805]
C58  C-EUC0805  [C0805]
C59  C-EUC0805  [C0805]
C60  CPOL-EUA/3216-18R  [A/3216-18R]
C63  CPOL-EU175TMP-0810  [175TMP-0810]
C64  C-EUC0805  [C0805]
C65  C-EUC0805  [C0805]
C66  CPOL-EUA/3216-18R  [A/3216-18R]
D13  DIODE-SMB  [SMB]
D14  STPS340U  DIODE-SMB  [SMB]
D15  DIODE-SMB  [SMB]
H1  MOUNT-HOLE2.8  [2,8]
H2  MOUNT-HOLE2.8  [2,8]
H3  MOUNT-HOLE2.8  [2,8]
H4  MOUNT-HOLE2.8  [2,8]
H5  MOUNT-HOLE2.8  [2,8]
H6  MOUNT-HOLE2.8  [2,8]
IC17  L78MXXAB  [D-PAK_TO252AA]
IC18  LM1117  [SOT223]
IC19  MC34063AD  [SOIC8]
JP1  PINHD-2X3  [2X03]
L1  SDR0805  [SDR0805]
LD2  LEDCHIPLED_0805  [CHIPLED_0805]
LD3  LEDCHIPLED_0805  [CHIPLED_0805]
P1  B3B-EH-A  [B3B-EH-A]
P2  B3B-EH-A  [B3B-EH-A]
P3  B3B-EH-A  [B3B-EH-A]
P4  B3B-EH-A  [B3B-EH-A]
P5  B3B-EH-A  [B3B-EH-A]
P6  B3B-EH-A  [B3B-EH-A]
R82  R-EU_M0805  [M0805]
R83  R-EU_M0805  [M0805]
R84  0.2  R-EU_R2512  [R2512]
R85  1.2k  R-EU_M0805  [M0805]
R86  13.2k  R-EU_M0805  [M0805]
U$1  MC33269DPAK  [D-PAK_TO252AA]

### Nets
+3V3D: C59.1 C60.+ IC18.2(OUTA) IC18.4(OUTB) JP1.2 P5.1
+5V: C65.1 C66.+ P4.1 U$1.4(OUT)
+5VA: C54.1 IC17.3(OUT) ; also sheet 2,3,4,5
+9V: C57.1 D15.A P6.1
+15V: C56.1 C63.+ IC17.1(IN) L1.2 P3.1 R86.1 ; also sheet 1,2
+24V: C55.1 D13.A P1.1 P2.1
AGND: C35.- C40.2 C54.2 C55.2 C56.2 C63.- D14.A IC17.4(GND) IC19.4(GND) P1.3 P2.3 P3.3 R82.1 R85.1 ; also sheet 1,2,3,4,5
DGND: C57.2 C58.2 C59.2 C60.- C64.2 C65.2 C66.- IC18.1(GND) P4.3 P5.3 P6.3 R83.1 U$1.1(GND) ; also sheet 2,3,4,5,6
EXT_VCC: JP1.6 ; also sheet 6
N$78: LD2.C R82.2
N$87: LD3.C R83.2
N$90: IC19.1(SWC) IC19.7(IS) IC19.8(DC) R84.2
N$92: IC19.5(FB) R85.2 R86.2
N$93: C40.1 IC19.3(TC)
N$94: C58.1 C64.1 D15.C IC18.3(IN) LD3.A U$1.3(IN)
N$95: D14.C IC19.2(SWE) L1.1
N$97: C35.+ D13.C IC19.6(VCC) LD2.A R84.1
VCCIO: JP1.3 JP1.4 ; also sheet 3,4,5,6
Unconnected: JP1.1 JP1.5 P1.2 P2.2 P3.2 P4.2 P5.2 P6.2

## Library data of the parts
C1 C12 C24 C31 C37 = resistor:CPOL-EU: POLARIZED CAPACITOR, European symbol
C2 C4-C11 C13-C23 C25 C29 C30 C32-C34 C36 C38 C39 C41-C50 C53 C61 C62 C67 C69-C75 = resistor:C-EU: CAPACITOR, European symbol
C3 C40 C54-C59 C64 C65 = rcl:C-EU: CAPACITOR, European symbol
C35 C60 C63 C66 = rcl:CPOL-EU: POLARIZED CAPACITOR, European symbol
D1 = diode:SUPPRESSOR-: Suppressor diode
D2 D3 D11 = ipc-7351-diode:SCHOTTKY_
D5-D7 = diode:BAS70: Silicon Schottky Diodes General-purpose diode for high-speed switching
D8-D10 D13-D15 = diode:DIODE-: DIODE
D16 = LM4041-N:LM4041-N: LM4041-N Precision Micropower Shunt Voltage Reference
H1-H6 = holes:MOUNT-HOLE: MOUNTING HOLE with drill center marker
IC1 = fairchild-semic:FSBB30CH60: Smart Power Module 600V-30A IGBT inverter for three-phase DC/AC power conversion Source: http://www.fairchildsemi.com/ds/FS/FSBB30CH60.pdf; MPN: FSBB30CH60B; OC_FARNELL: 1783234; OC_NEWARK: 78M1076
IC2 = 40xx:4049: Hex inverting BUFFER
IC3-IC6 IC10 IC11 = linear:LM358: OP AMP also LM158; LM258; LM2904 Source: http://cache.national.com/ds/LM/LM158.pdf
IC7-IC9 IC12 = IL300:IL300: Linear Optocoupler, High Gain Stability, Wide Bandwidth Source: https://www.vishay.com/docs/83622/il300.pdf
IC13 IC14 = HCPL-3180-300E:HCPL-3180-300E: Broadcom HCPL-3180-300E DC Input IGBT Gate Drive Output Dual Optocoupler, Surface Mount, 8-Pin DIP Source: Datasheet <http://docs-emea.rs-online.com/webdocs/130f/0900766b8130f7ab.pdf>; DESCRIPTION: Broadcom HCPL-3180-300E DC Input IGBT Gate Drive Output Dual Optocoupler, Surface Mount, 8-Pin DIP; HEIGHT: mm; MANUFACTURER_NAME: Avago Technologies; MANUFACTURER_PART_NUMBER: HCPL-3180-300E; MOUSER_PART_NUMBER: 630-HCPL-3180-300E; MOUSER_PRICE-STOCK: https://www.mouser.com/Search/Refine.aspx?Keyword=630-HCPL-3180-300E; RS_PART_NUMBER: 8188347P; RS_PRICE-STOCK: http://uk.rs-online.com/web/p/products/8188347P
IC15 = 74xx-eu:74*14: Hex schmitt trigger INVERTER
IC17 = L78MxxAB:L78MXXAB
IC18 = LM1117S33TR:LM1117
IC19 = mc34063:MC34063
J1 = Connectors:0480251190: CONN MAGJACK 1PORT 100 BASE-T Manufacturer's datasheet <https://www.molex.com/pdm_docs/sd/480251090_sd.pdf>; CREATED_BY: PCBLayout.com; DIGIKEY_PART_NUMBER: WM5484-ND; MANUFACTURER: Molex; MPN: 0480251190
JP1 = pinhead:PINHD-2X3: PIN HEADER
K3 = HJR-21FF:HJR-21FF: Relay, 1 Form C, 12VDC Source: Datasheet <http://e-rebirth.net/car/trkm.pdf>
L1 = inductor-bourns:SDR0805: POWER INDUCTOR
LD2 LD3 = led:LED: LED OSRAM: - CHIPLED LG R971, LG N971, LY N971, LG Q971, LY Q971, LO R971, LY R971 LH N974, LH R974 LS Q976, LO Q976, LY Q976 LO Q996 - Hyper CHIPLED LW Q18S LB Q993, LB Q99A, LB R99A - SideLED LS A670, LO A670, LY A670, LG A670, LP A670 LB A673, LV A673, LT A673, LW A673 LH A674 LY A675 LS A676, LA A676, LO A676, LY A676, LW A676 LS A679, LY A679, LG A679 - Hyper Micro SIDELED® LS Y876, LA Y876, LO Y876, LY Y876 LT Y87S - SmartLED LW L88C, LW L88S LB L89C, LB L89S, LG L890 LS L89K, LO L89K, LY L89K LS L896, LA L896, LO L896, LY L896 - TOPLED LS T670, LO T670, LY T670, LG T670, LP T670 LSG T670, LSP T670, LSY T670, LOP T670, LYG T670 LG T671, LOG T671, LSG T671 LB T673, LV T673, LT T673, LW T673 LH T674 LS T676, LA T676, LO T676, LY T676, LB T676, LH T676, LSB T676, LW T676 LB T67C, LV T67C, LT T67C, LS T67K, LO T67K, LY T67K, LW E67C LS E67B, LA E67B, LO E67B, LY E67B, LB E67C, LV E67C, LT E67C LW T67C LS T679, LY T679, LG T679 LS T770, LO T770, LY T770, LG T770, LP T770 LB T773, LV T773, LT T773, LW T773 LH T774 LS E675, LA E675, LY E675, LS T675 LS T776, LA T776, LO T776, LY T776, LB T776 LHGB T686 LT T68C, LB T68C - Hyper Mini TOPLED® LB M676 - Mini TOPLED Santana® LG M470 LS M47K, LO M47K, LY M47K Source: http://www.osram.convergy.de/
OK1-OK4 = optocoupler:HCPL2530: HEWLETT PACKARD OPTO COUPLER; MF: AGILENT TECHNOLOGIES; MPN: HCPL-2530-000E; OC_FARNELL: 9994793; OC_NEWARK: 31K6974
P1-P6 = con-jst-eh:B3B-EH-A: HEADER
Q1 Q3 = transistor-npn:BC817*: NPN Transistor
Q2 = transistor-power:IRFP240: HEXFET Power MosFet Source: http://www.irf.com/
R1 R2 R4-R12 R15-R19 R22 R24 R26-R39 R44 R47-R62 R65-R69 R73 R75 R77 R79-R81 R87-R101 = resistor:R-EU_: RESISTOR, European symbol
R78 = varistor:THERMISTOR: THERMISTOR
R82-R86 = rcl:R-EU_: RESISTOR, European symbol
SV1 = con-ml:ML20: HARTING
U$1 = mc33269:MC33269: MC33269 voltage regulator, by ON semiconductor, in TO220 package
U$2 = TS391:TS391: TS391 Low-power single voltage comparator
X1 X2 X4 = DG129:DG129-7.5-02P
X3 = DG129:DG129-7.5-03P